# Altium project miwi.PrjPCB
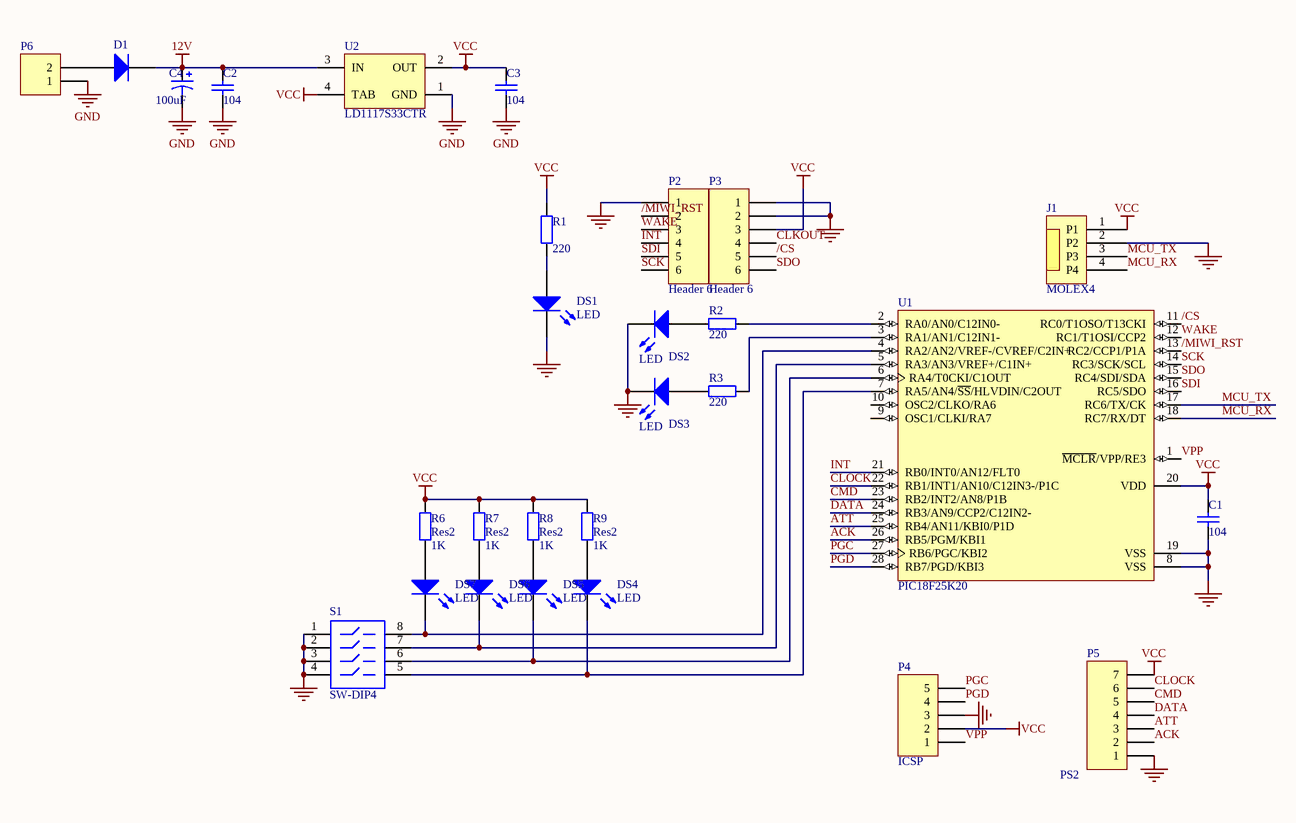
[diagram p0: miwi.SchDoc]
1 sheet, 28 parts. Net scope: global (net labels, ports and power ports of the same name join across sheets).
Board file: miwi.PcbDoc

## Sheet miwi.SchDoc
size B

### Parts
C1  value 104  [CAPR5.08-7.8x3.2]
C2  value 104  [CAPR5.08-7.8x3.2]
C3  value 104  [CAPR5.08-7.8x3.2]
C4  value 100uF  [CAPPR2.5-6.3x5]
D1  MULTICOMP - S3J - DIODE, STANDARD, 3A, 600V, SMD  [SMC]  (value not drawn)
DS1  LED  [LED]
DS2  LED  [LED]
DS3  LED  [LED]
DS4  LED  [LED]
DS5  LED  [LED]
DS6  LED  [LED]
DS7  LED  [LED]
J1  MOLEX4  [MOLEX4]
P2  Header 6  [HDR1X6]
P3  Header 6  [HDR1X6]
P4  ICSP  [HDR1X5]
P5  PS2  [KK Header 6410-7]
P6  12V Input  [KK Header 6410-2]  (value not drawn)
R1  value 220  [AXIAL-0.4]
R2  value 220  [AXIAL-0.4]
R3  value 220  [AXIAL-0.4]
R6  Res2  value 1K  [AXIAL-0.4]
R7  Res2  value 1K  [AXIAL-0.4]
R8  Res2  value 1K  [AXIAL-0.4]
R9  Res2  value 1K  [AXIAL-0.4]
S1  SW-DIP4  [DIP-8]
U1  PIC18F25K20  [PDIP-28]
U2  LD1117S33CTR  [MP04A_N]

### Nets
12V: C2.2 C4.1 D1.2(K) U2.3(IN)
GND: C1.1 C2.1 C3.1 C4.2 DS1.2(K) DS2.2(K) DS3.2(K) J1.2(P2) P2.1 P3.1 P3.2 P4.3 P5.1 P6.1 S1.1 S1.2 S1.3 S1.4 U1.8(VSS) U1.19(VSS) U2.1(GND)
VCC: C1.2 C3.2 J1.1(P1) P3.3 P4.2 P5.7 R1.2 R6.2 R7.2 R8.2 R9.2 U1.20(VDD) U2.2(OUT) U2.4(TAB)
/CS: P3.5 U1.11(RC0/T1OSO/T13CKI)
/MIWI_RST: P2.2 U1.13(RC2/CCP1/P1A)
ACK: P5.2 U1.26(RB5/PGM/KBI1)
ATT: P5.3 U1.25(RB4/AN11/KBI0/P1D)
CLKOUT: P3.4
CLOCK: P5.6 U1.22(RB1/INT1/AN10/C12IN3-/P1C)
CMD: P5.5 U1.23(RB2/INT2/AN8/P1B)
DATA: P5.4 U1.24(RB3/AN9/CCP2/C12IN2-)
INT: P2.4 U1.21(RB0/INT0/AN12/FLT0)
MCU_RX: J1.4(P4) U1.18(RC7/RX/DT)
MCU_TX: J1.3(P3) U1.17(RC6/TX/CK)
PGC: P4.5 U1.27(RB6/PGC/KBI2)
PGD: P4.4 U1.28(RB7/PGD/KBI3)
SCK: P2.6 U1.14(RC3/SCK/SCL)
SDI: P2.5 U1.16(RC5/SDO)
SDO: P3.6 U1.15(RC4/SDI/SDA)
VPP: P4.1 U1.1(~{MCLR}/VPP/RE3)
WAKE: P2.3 U1.12(RC1/T1OSI/CCP2)
NetD1_1: D1.1(A) P6.2
NetDS1_1: DS1.1(A) R1.1
NetDS2_1: DS2.1(A) R2.1
NetDS3_1: DS3.1(A) R3.1
NetDS4_1: DS4.1(A) R9.1
NetDS4_2: DS4.2(K) S1.5 U1.7(RA5/AN4/~{SS}/HLVDIN/C2OUT)
NetDS5_1: DS5.1(A) R8.1
NetDS5_2: DS5.2(K) S1.6 U1.6(RA4/T0CKI/C1OUT)
NetDS6_1: DS6.1(A) R7.1
NetDS6_2: DS6.2(K) S1.7 U1.5(RA3/AN3/VREF+/C1IN+)
NetDS7_1: DS7.1(A) R6.1
NetDS7_2: DS7.2(K) S1.8 U1.4(RA2/AN2/VREF-/CVREF/C2IN+)
NetR2_2: R2.2 U1.2(RA0/AN0/C12IN0-)
NetR3_2: R3.2 U1.3(RA1/AN1/C12IN1-)

Not connected (* = marked no-connect by the designer): U1 9(OSC1/CLKI/RA7) 10(OSC2/CLKO/RA6)

### Library data of the parts
C1-C3 = Cap: Capacitor; Published: 8-Jun-2000; LatestRevisionDate: 17-Jul-2002; LatestRevisionNote: Re-released for DXP Platform.; Publisher: Altium Limited
C4 = Cap Pol1: Polarized Capacitor (Radial); Published: 8-Jun-2000; LatestRevisionDate: 17-Jul-2002; LatestRevisionNote: Re-released for DXP Platform.; Publisher: Altium Limited
D1 = Diode: Default Diode; Published: 8-Jun-2000; LatestRevisionDate: 17-Jul-2002; LatestRevisionNote: Re-released for DXP Platform.; PackageVersion: Sep-1996; PackageReference: SMC; Publisher: Altium Limited; PackageDescription: DO-214-AB/SMC; 2 C-Bend Leads; Body 7.9 x 5.9 mm, inc. leads (LxW); Code_JEDEC: DO-214-AB
P2 P3 = Header 6: Header, 6-Pin; LatestRevisionDate: 17-Jul-2002; LatestRevisionNote: Re-released for DXP Platform.; Publisher: Altium Limited
P4 = Header 5: Header, 5-Pin; LatestRevisionDate: 17-Jul-2002; LatestRevisionNote: Re-released for DXP Platform.; Publisher: Altium Limited
P5 = Header 7 Type 1: Header, 7-Pin, KK Header 6410, 100mil; LatestRevisionDate: 17-Jul-2002; LatestRevisionNote: Re-released for DXP Platform.; Publisher: Altium Limited
P6 = Header 2 Type 1: Header, 2-Pin, KK Header 6410, 100mil; LatestRevisionDate: 17-Jul-2002; LatestRevisionNote: Re-released for DXP Platform.; Publisher: Altium Limited
R1-R3 R6-R9 = Res2: Resistor; Published: 8-Jun-2000; LatestRevisionDate: 17-Jul-2002; LatestRevisionNote: Re-released for DXP Platform.; Publisher: Altium Limited
S1 = SW-DIP4: DIP Switch; Published: 24-Mar-1999; LatestRevisionDate: 17-Jul-2002; LatestRevisionNote: Re-released for DXP Platform.; Publisher: Altium Limited
U2 = LM1117IMPX-3.3: 800mA Low-Dropout Linear Regulator, 4-pin SOT-223; Manufacturer: National Semiconductor; PackageTopMarking: XYTT*N05B; PowerWise: N; CompType: LDO IC; Published: 1-Mar-2010; DatasheetVersion: Apr-2006; PackageVersion: revB, Apr-2003; PackageReference: MP04A; Publisher: Altium Limited; PackageDescription: Molded SOT-223, 6.50 x 3.56 x 1.6mm Body, 4 Lead, 2.3mm Pitch; PartNumber: LM1117IMPX-3.3; RoHS: N; PinCount: 4; Code_JEDEC: TO-261-AA; Code_IPC: SOT223-4; ComponentLink1Description: LM1117 Datasheet; ComponentLink1URL: http://www.national.com/ds/LM/LM1117.pdf; ComponentLink2Description: LM1117 Web Page; ComponentLink2URL: http://www.national.com/pf/LM/LM1117.html; ComponentLink3Description: MP04A Package Page; ComponentLink3URL: http://www.national.com/packaging/folders/mp04a.html